# Altium schematic sheet Power Supply.SchDoc: PNEV5180B
size A3; Date: 15.9.2015; DrawnBy: GVR; Address1: A3; Revision: 2.0; SheetNumber: 1; SheetTotal: 3
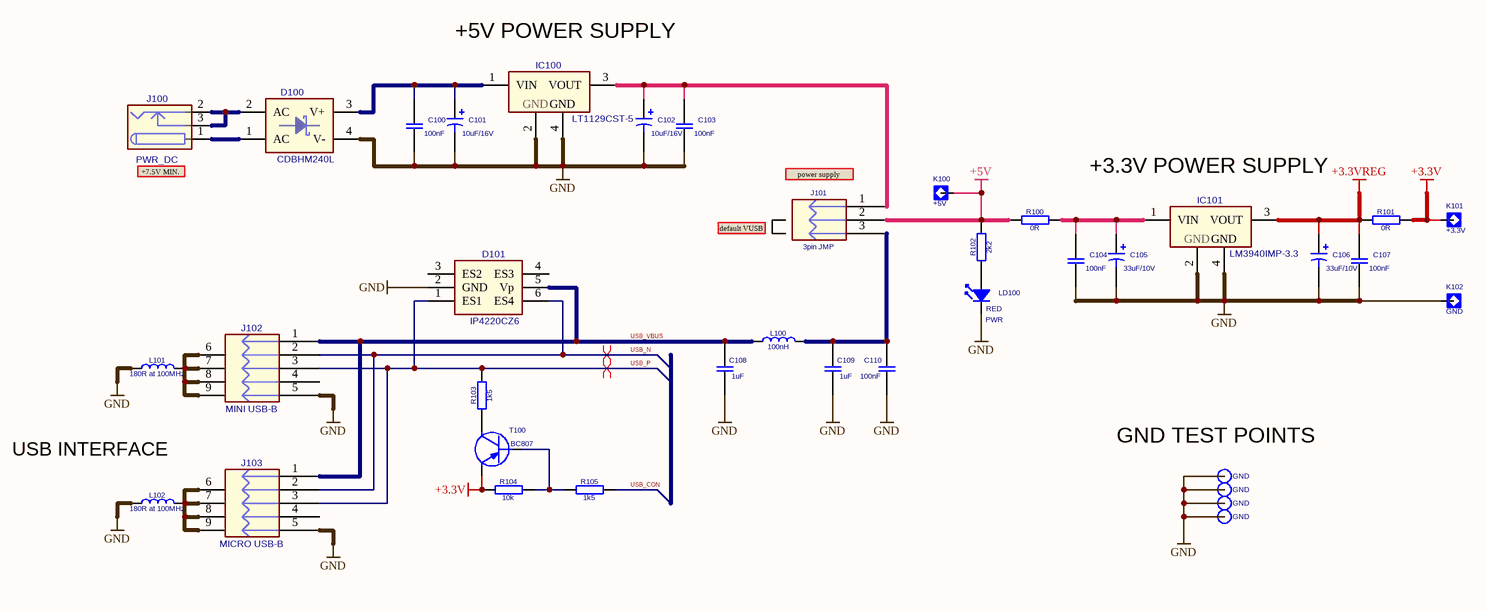
[diagram p0: Power Supply.SchDoc]

## Parts
?  (no value)
C100  100nF  [Y0603]
C101  10uF/16V  [CAP_TANT_1206_CASE-A]
C102  10uF/16V  [CAP_TANT_1206_CASE-A]
C103  100nF  [Y0603]
C104  100nF  [Y0603]
C105  33uF/10V  [C_TANTAL_B]
C106  33uF/10V  [C_TANTAL_B]
C107  100nF  [Y0603]
C108  1uF  [Y0603]
C109  1uF  [Y0603]
C110  100nF  [Y0603]
D100  CDBHM240L  [GRETZ_MBS2]
D101  IP4220CZ6  [SOT-457]
IC100  LT1129CST-5  [SOT-223-3]
IC101  LM3940IMP-3.3  [SOT-223-3]
J100  value PWR_DC  [CON_JCK_2.5mm]  (hidden comment: PWR_DC_PJ-202A)
J101  3pin JMP  [CON3M-LINE]
J102  MINI USB-B  [CON_USB-B-MINI_SD-67503-010_5075BMR-05-SM-CR]
J103  MICRO USB-B  [CON_USB_MICRO_B_WE-629 105 136 821]
K100  value +5V  [TESTP_ROUND_1.0mm]  (hidden comment: TP1)
K101  value +3.3V  [TESTP_ROUND_1.0mm]  (hidden comment: TP1)
K102  value GND  [TESTP_ROUND_1.0mm]  (hidden comment: TP1)
K103  value GND  [CON1_PIN_Round_1.0x1.8mm]  (hidden comment: TP_1.0mm)
K104  value GND  [CON1_PIN_Round_1.0x1.8mm]  (hidden comment: TP_1.0mm)
K105  value GND  [CON1_PIN_Round_1.0x1.8mm]  (hidden comment: TP_1.0mm)
K106  value GND  [CON1_PIN_Round_1.0x1.8mm]  (hidden comment: TP_1.0mm)
L100  100nH  [INDCC_1812]
L101  value 180R at 100MHz  [Y0603]  (hidden comment: BLM18PG181SN1)
L102  value 180R at 100MHz  [Y0603]  (hidden comment: BLM18PG181SN1)
LD100  RED  [LED_0603]
R100  0R  [Y0603]
R101  0R  [Y0603]
R102  2k2  [Y0603]
R103  1k5  [Y0603]
R104  10k  [Y0603]
R105  1k5  [Y0603]
T100  BC807  [SOT-23]

## Nets
+3.3V: K101.1 R101.1 R104.2 T100.2(E)
+3.3VREG: C106.1 C107.1 IC101.3(VOUT) R101.2
+5V: J101.2(P2) K100.1 R100.2 R102.2
GND: C100.2 C101.2 C102.2 C103.2 C104.2 C105.2 C106.2 C107.2 C108.2 C109.2 C110.2 D100.4(V-) D101.2(GND) IC100.2(GND) IC100.4(GND) IC101.2(GND) IC101.4(GND) J102.5(GND) J103.5(GND) K102.1 K103.1 K104.1 K105.1 K106.1 L101.1 L102.1 LD100.1
USB_CON: R105.1
USB_N: D101.6(ES4) J102.2(D-) J103.2(D-)
USB_P: D101.1(ES1) J102.3(D+) J103.3(D+) R103.1
USB_VBUS: C108.1 D101.5(Vp) J102.1(VBUS) J103.1(VBUS) L100.1
NetC100_1: C100.1 C101.1 D100.3(V+) IC100.1(VIN)
NetC102_1: C102.1 C103.1 IC100.3(VOUT) J101.1(P1)
NetC104_1: C104.1 C105.1 IC101.1(VIN) R100.1
NetC109_1: C109.1 C110.1 J101.3(P3) L100.2
NetD100_1: D100.1(AC) J100.1
NetD100_2: D100.2(AC) J100.2 J100.3
NetJ102_6: J102.6(Case1) J102.7(Case2) J102.8(Case3) J102.9(Case4) L101.2
NetJ103_6: J103.6(Case1) J103.7(Case2) J103.8(Case3) J103.9(Case4) L102.2
NetLD100_2: LD100.2 R102.1
NetR103_2: R103.2 T100.3(C)
NetR104_1: R104.1 R105.2 T100.1(B)

Not connected (* = marked no-connect by the designer): D101 3(ES2) 4(ES3); J102 4(ID); J103 4(ID)

## Layout directives
differential pair: USB_N, USB_P

## Notes on the sheet
- (near IC100) +5V POWER SUPPLY
- (near J100) +7.5V MIN.
- (near J101) power supply jumper
- +3.3V POWER SUPPLY
- default VUSB
- (near L102) USB INTERFACE
- GND TEST POINTS
- Title:
- Date:
- File:
- Revision:
- Drawn By:
- Sheet:
- Paper Size:
- of
- (in symbol LEDY0603) PWR

## Library data of the parts
? = Title Block NXP
C100 C103 C104 C107-C110 = CAPC0603
  C100 C103 C104 C107 C110: Value: 100nF
  C108 C109: Value: 1uF
C101 C102 = C_TANTAL_1206: DNP: DNP; Value: 10uF/16V
C105 C106 = C_TANTAL_B: DNP: DNP; Value: 33uF/10V
D100 = GRETZ_MBS2: GRETZ_MBS2_Schottky; DNP: DNP; Value: CDBHM240L
D101 = D_IP4220CZ6: Value: IP4220CZ6
IC100 = LM3940-3.3: also for: LT1129IST-5; DNP: DNP; Value: LT1129CST-5
IC101 = LM3940-3.3: DNP: DNP; Value: LM3940IMP-3.3
J100 = CON_JCK_2.5mm: PWR_JACK_2.1mm x 5.5mm; DigiKey: PJ-202A; DNP: DNP
J101 = CON3M_LINE
J102 = CON_USB_B_RA: Value: 548190572 (DigiKey); Value: 675031020 (DigiKey); also for: 5075BMR-05-SM-CR (IC-Elektronika)
J103 = CON_USB_MICRO_B: Value: 629105136821 (Wurth); DNP: DNP
L100 = INDC1812: Value: 100nH
L101 L102 = INDC0603: DNP: DNP; Value: BLM18PG181SN1
LD100 = LEDY0603: Value: RED; DNP: DNP
R100-R105 = RESC0603
  R100 R101: Value: 0R
  R102: Value: 2k2
  R103 R105: Value: 1k5
  R104: Value: 10k
K103-K106 = TP_1.0mm: DNP: DNP